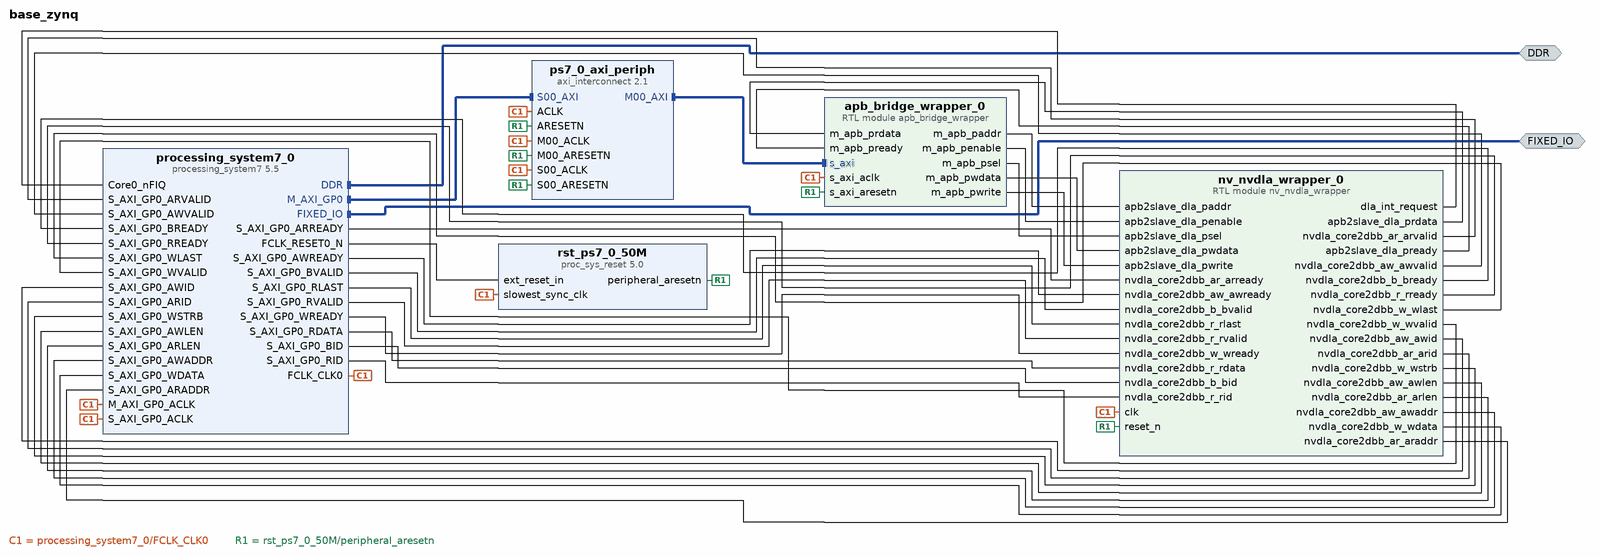
[diagram p0: block diagram of the top level]
# Vivado block design base_zynq, xc7z020clg400-1, Vivado 2019.2.1
create_bd_design base_zynq

create_bd_intf_port -mode Master -vlnv xilinx.com:interface:ddrx_rtl:1.0 DDR
create_bd_intf_port -mode Master -vlnv xilinx.com:display_processing_system7:fixedio_rtl:1.0 FIXED_IO

create_bd_cell -type ip -vlnv xilinx.com:ip:processing_system7:5.5 processing_system7_0
set_property -dict [list \
  CONFIG.PCW_APU_PERIPHERAL_FREQMHZ 666.666666 \
  CONFIG.PCW_CAN0_CAN0_IO {MIO 46 .. 47} \
  CONFIG.PCW_CAN0_PERIPHERAL_ENABLE 1 \
  CONFIG.PCW_CAN_PERIPHERAL_FREQMHZ 23.8095 \
  CONFIG.PCW_CORE0_FIQ_INTR 1 \
  CONFIG.PCW_ENET0_ENET0_IO {MIO 16 .. 27} \
  CONFIG.PCW_ENET0_GRP_MDIO_ENABLE 1 \
  CONFIG.PCW_ENET0_GRP_MDIO_IO {MIO 52 .. 53} \
  CONFIG.PCW_ENET0_PERIPHERAL_ENABLE 1 \
  CONFIG.PCW_ENET0_PERIPHERAL_FREQMHZ {100 Mbps} \
  CONFIG.PCW_ENET0_RESET_ENABLE 1 \
  CONFIG.PCW_ENET0_RESET_IO {MIO 11} \
  CONFIG.PCW_ENET_RESET_ENABLE 1 \
  CONFIG.PCW_ENET_RESET_SELECT {Share reset pin} \
  CONFIG.PCW_FPGA1_PERIPHERAL_FREQMHZ 50 \
  CONFIG.PCW_GPIO_MIO_GPIO_ENABLE 1 \
  CONFIG.PCW_GPIO_MIO_GPIO_IO MIO \
  CONFIG.PCW_I2C0_GRP_INT_ENABLE 0 \
  CONFIG.PCW_I2C0_I2C0_IO {MIO 50 .. 51} \
  CONFIG.PCW_I2C0_PERIPHERAL_ENABLE 1 \
  CONFIG.PCW_I2C0_RESET_ENABLE 1 \
  CONFIG.PCW_I2C0_RESET_IO {MIO 13} \
  CONFIG.PCW_I2C_PERIPHERAL_FREQMHZ 111.111115 \
  CONFIG.PCW_I2C_RESET_ENABLE 1 \
  CONFIG.PCW_I2C_RESET_SELECT {Share reset pin} \
  CONFIG.PCW_IMPORT_BOARD_PRESET D:/uni/2019-2020/thesis/cogitantium/board_documentation/zynq_block_system_configuration.tcl \
  CONFIG.PCW_PRESET_BANK0_VOLTAGE {LVCMOS 1.8V} \
  CONFIG.PCW_PRESET_BANK1_VOLTAGE {LVCMOS 1.8V} \
  CONFIG.PCW_QSPI_GRP_FBCLK_ENABLE 1 \
  CONFIG.PCW_QSPI_GRP_FBCLK_IO {MIO 8} \
  CONFIG.PCW_QSPI_GRP_SINGLE_SS_ENABLE 1 \
  CONFIG.PCW_QSPI_GRP_SINGLE_SS_IO {MIO 1 .. 6} \
  CONFIG.PCW_QSPI_PERIPHERAL_ENABLE 1 \
  CONFIG.PCW_QSPI_QSPI_IO {MIO 1 .. 6} \
  CONFIG.PCW_SD0_GRP_CD_ENABLE 1 \
  CONFIG.PCW_SD0_GRP_CD_IO {MIO 0} \
  CONFIG.PCW_SD0_GRP_WP_ENABLE 1 \
  CONFIG.PCW_SD0_GRP_WP_IO {MIO 15} \
  CONFIG.PCW_SD0_PERIPHERAL_ENABLE 1 \
  CONFIG.PCW_SD0_SD0_IO {MIO 40 .. 45} \
  CONFIG.PCW_SDIO_PERIPHERAL_FREQMHZ 50 \
  CONFIG.PCW_SINGLE_QSPI_DATA_MODE x4 \
  CONFIG.PCW_TTC0_PERIPHERAL_ENABLE 1 \
  CONFIG.PCW_TTC0_TTC0_IO EMIO \
  CONFIG.PCW_UART1_PERIPHERAL_ENABLE 1 \
  CONFIG.PCW_UART1_UART1_IO {MIO 48 .. 49} \
  CONFIG.PCW_UART_PERIPHERAL_FREQMHZ 50 \
  CONFIG.PCW_UIPARAM_DDR_FREQ_MHZ 533.333333 \
  CONFIG.PCW_UIPARAM_DDR_PARTNO {MT41J256M8 HX-15E} \
  CONFIG.PCW_USB0_PERIPHERAL_ENABLE 1 \
  CONFIG.PCW_USB0_RESET_ENABLE 1 \
  CONFIG.PCW_USB0_RESET_IO {MIO 7} \
  CONFIG.PCW_USB0_USB0_IO {MIO 28 .. 39} \
  CONFIG.PCW_USB_RESET_ENABLE 1 \
  CONFIG.PCW_USB_RESET_SELECT {Share reset pin} \
  CONFIG.PCW_USE_FABRIC_INTERRUPT 1 \
  CONFIG.PCW_USE_S_AXI_GP0 1 \
  CONFIG.preset ZC702 \
] [get_bd_cells processing_system7_0]
# 263 more settings of processing_system7_0 are not shown: defaults, MIO pin electricals, DDR timing, and values the tool derives
create_bd_cell -type ip -vlnv xilinx.com:ip:axi_interconnect:2.1 ps7_0_axi_periph
set_property -dict {CONFIG.NUM_MI 1} [get_bd_cells ps7_0_axi_periph]
create_bd_cell -type ip -vlnv xilinx.com:ip:proc_sys_reset:5.0 rst_ps7_0_50M
create_bd_cell -type module -reference apb_bridge_wrapper apb_bridge_wrapper_0
create_bd_cell -type module -reference nv_nvdla_wrapper nv_nvdla_wrapper_0

# ---- connections ----

connect_bd_intf_net [get_bd_intf_pins apb_bridge_wrapper_0/s_axi] [get_bd_intf_pins ps7_0_axi_periph/M00_AXI]
connect_bd_intf_net [get_bd_intf_ports DDR] [get_bd_intf_pins processing_system7_0/DDR]
connect_bd_intf_net [get_bd_intf_ports FIXED_IO] [get_bd_intf_pins processing_system7_0/FIXED_IO]
connect_bd_intf_net [get_bd_intf_pins processing_system7_0/M_AXI_GP0] [get_bd_intf_pins ps7_0_axi_periph/S00_AXI]
connect_bd_net [get_bd_pins processing_system7_0/FCLK_CLK0] \
  [get_bd_pins processing_system7_0/M_AXI_GP0_ACLK] [get_bd_pins ps7_0_axi_periph/ACLK] \
  [get_bd_pins ps7_0_axi_periph/S00_ACLK] [get_bd_pins ps7_0_axi_periph/M00_ACLK] \
  [get_bd_pins rst_ps7_0_50M/slowest_sync_clk] [get_bd_pins processing_system7_0/S_AXI_GP0_ACLK] \
  [get_bd_pins apb_bridge_wrapper_0/s_axi_aclk] [get_bd_pins nv_nvdla_wrapper_0/clk]
connect_bd_net [get_bd_pins processing_system7_0/FCLK_RESET0_N] [get_bd_pins rst_ps7_0_50M/ext_reset_in]
connect_bd_net [get_bd_pins rst_ps7_0_50M/peripheral_aresetn] \
  [get_bd_pins ps7_0_axi_periph/ARESETN] [get_bd_pins ps7_0_axi_periph/S00_ARESETN] \
  [get_bd_pins ps7_0_axi_periph/M00_ARESETN] [get_bd_pins apb_bridge_wrapper_0/s_axi_aresetn] \
  [get_bd_pins nv_nvdla_wrapper_0/reset_n]
connect_bd_net [get_bd_pins nv_nvdla_wrapper_0/dla_int_request] [get_bd_pins processing_system7_0/Core0_nFIQ]
connect_bd_net [get_bd_pins apb_bridge_wrapper_0/m_apb_paddr] [get_bd_pins nv_nvdla_wrapper_0/apb2slave_dla_paddr]
connect_bd_net [get_bd_pins apb_bridge_wrapper_0/m_apb_penable] [get_bd_pins nv_nvdla_wrapper_0/apb2slave_dla_penable]
connect_bd_net [get_bd_pins apb_bridge_wrapper_0/m_apb_psel] [get_bd_pins nv_nvdla_wrapper_0/apb2slave_dla_psel]
connect_bd_net [get_bd_pins apb_bridge_wrapper_0/m_apb_pwdata] [get_bd_pins nv_nvdla_wrapper_0/apb2slave_dla_pwdata]
connect_bd_net [get_bd_pins apb_bridge_wrapper_0/m_apb_pwrite] [get_bd_pins nv_nvdla_wrapper_0/apb2slave_dla_pwrite]
connect_bd_net [get_bd_pins nv_nvdla_wrapper_0/apb2slave_dla_prdata] [get_bd_pins apb_bridge_wrapper_0/m_apb_prdata]
connect_bd_net [get_bd_pins nv_nvdla_wrapper_0/apb2slave_dla_pready] [get_bd_pins apb_bridge_wrapper_0/m_apb_pready]
connect_bd_net [get_bd_pins processing_system7_0/S_AXI_GP0_ARREADY] [get_bd_pins nv_nvdla_wrapper_0/nvdla_core2dbb_ar_arready]
connect_bd_net [get_bd_pins processing_system7_0/S_AXI_GP0_AWREADY] [get_bd_pins nv_nvdla_wrapper_0/nvdla_core2dbb_aw_awready]
connect_bd_net [get_bd_pins processing_system7_0/S_AXI_GP0_BVALID] [get_bd_pins nv_nvdla_wrapper_0/nvdla_core2dbb_b_bvalid]
connect_bd_net [get_bd_pins processing_system7_0/S_AXI_GP0_RLAST] [get_bd_pins nv_nvdla_wrapper_0/nvdla_core2dbb_r_rlast]
connect_bd_net [get_bd_pins processing_system7_0/S_AXI_GP0_RVALID] [get_bd_pins nv_nvdla_wrapper_0/nvdla_core2dbb_r_rvalid]
connect_bd_net [get_bd_pins processing_system7_0/S_AXI_GP0_WREADY] [get_bd_pins nv_nvdla_wrapper_0/nvdla_core2dbb_w_wready]
connect_bd_net [get_bd_pins processing_system7_0/S_AXI_GP0_RDATA] [get_bd_pins nv_nvdla_wrapper_0/nvdla_core2dbb_r_rdata]
connect_bd_net [get_bd_pins processing_system7_0/S_AXI_GP0_BID] [get_bd_pins nv_nvdla_wrapper_0/nvdla_core2dbb_b_bid]
connect_bd_net [get_bd_pins processing_system7_0/S_AXI_GP0_RID] [get_bd_pins nv_nvdla_wrapper_0/nvdla_core2dbb_r_rid]
connect_bd_net [get_bd_pins nv_nvdla_wrapper_0/nvdla_core2dbb_ar_arvalid] [get_bd_pins processing_system7_0/S_AXI_GP0_ARVALID]
connect_bd_net [get_bd_pins nv_nvdla_wrapper_0/nvdla_core2dbb_aw_awvalid] [get_bd_pins processing_system7_0/S_AXI_GP0_AWVALID]
connect_bd_net [get_bd_pins nv_nvdla_wrapper_0/nvdla_core2dbb_b_bready] [get_bd_pins processing_system7_0/S_AXI_GP0_BREADY]
connect_bd_net [get_bd_pins nv_nvdla_wrapper_0/nvdla_core2dbb_r_rready] [get_bd_pins processing_system7_0/S_AXI_GP0_RREADY]
connect_bd_net [get_bd_pins nv_nvdla_wrapper_0/nvdla_core2dbb_w_wlast] [get_bd_pins processing_system7_0/S_AXI_GP0_WLAST]
connect_bd_net [get_bd_pins nv_nvdla_wrapper_0/nvdla_core2dbb_w_wvalid] [get_bd_pins processing_system7_0/S_AXI_GP0_WVALID]
connect_bd_net [get_bd_pins nv_nvdla_wrapper_0/nvdla_core2dbb_aw_awid] [get_bd_pins processing_system7_0/S_AXI_GP0_AWID]
connect_bd_net [get_bd_pins nv_nvdla_wrapper_0/nvdla_core2dbb_ar_arid] [get_bd_pins processing_system7_0/S_AXI_GP0_ARID]
connect_bd_net [get_bd_pins nv_nvdla_wrapper_0/nvdla_core2dbb_w_wstrb] [get_bd_pins processing_system7_0/S_AXI_GP0_WSTRB]
connect_bd_net [get_bd_pins nv_nvdla_wrapper_0/nvdla_core2dbb_aw_awlen] [get_bd_pins processing_system7_0/S_AXI_GP0_AWLEN]
connect_bd_net [get_bd_pins nv_nvdla_wrapper_0/nvdla_core2dbb_ar_arlen] [get_bd_pins processing_system7_0/S_AXI_GP0_ARLEN]
connect_bd_net [get_bd_pins nv_nvdla_wrapper_0/nvdla_core2dbb_aw_awaddr] [get_bd_pins processing_system7_0/S_AXI_GP0_AWADDR]
connect_bd_net [get_bd_pins nv_nvdla_wrapper_0/nvdla_core2dbb_w_wdata] [get_bd_pins processing_system7_0/S_AXI_GP0_WDATA]
connect_bd_net [get_bd_pins nv_nvdla_wrapper_0/nvdla_core2dbb_ar_araddr] [get_bd_pins processing_system7_0/S_AXI_GP0_ARADDR]
set_property HDL_ATTRIBUTE.BMM_INFO_PROCESSOR {arm > base_zynq axi_bram_ctrl_0} [get_bd_cells processing_system7_0]
set_property HDL_ATTRIBUTE.KEEP_HIERARCHY yes [get_bd_cells processing_system7_0]

# ---- address map ----
assign_bd_address -offset 0x40000000 -range 64K -target_address_space [get_bd_addr_spaces processing_system7_0/Data] [get_bd_addr_segs apb_bridge_wrapper_0/s_axi/reg0]

validate_bd_design
save_bd_design
